# EAGLE schematic brick_analog_limitswitch (EAGLE 7.4.0)
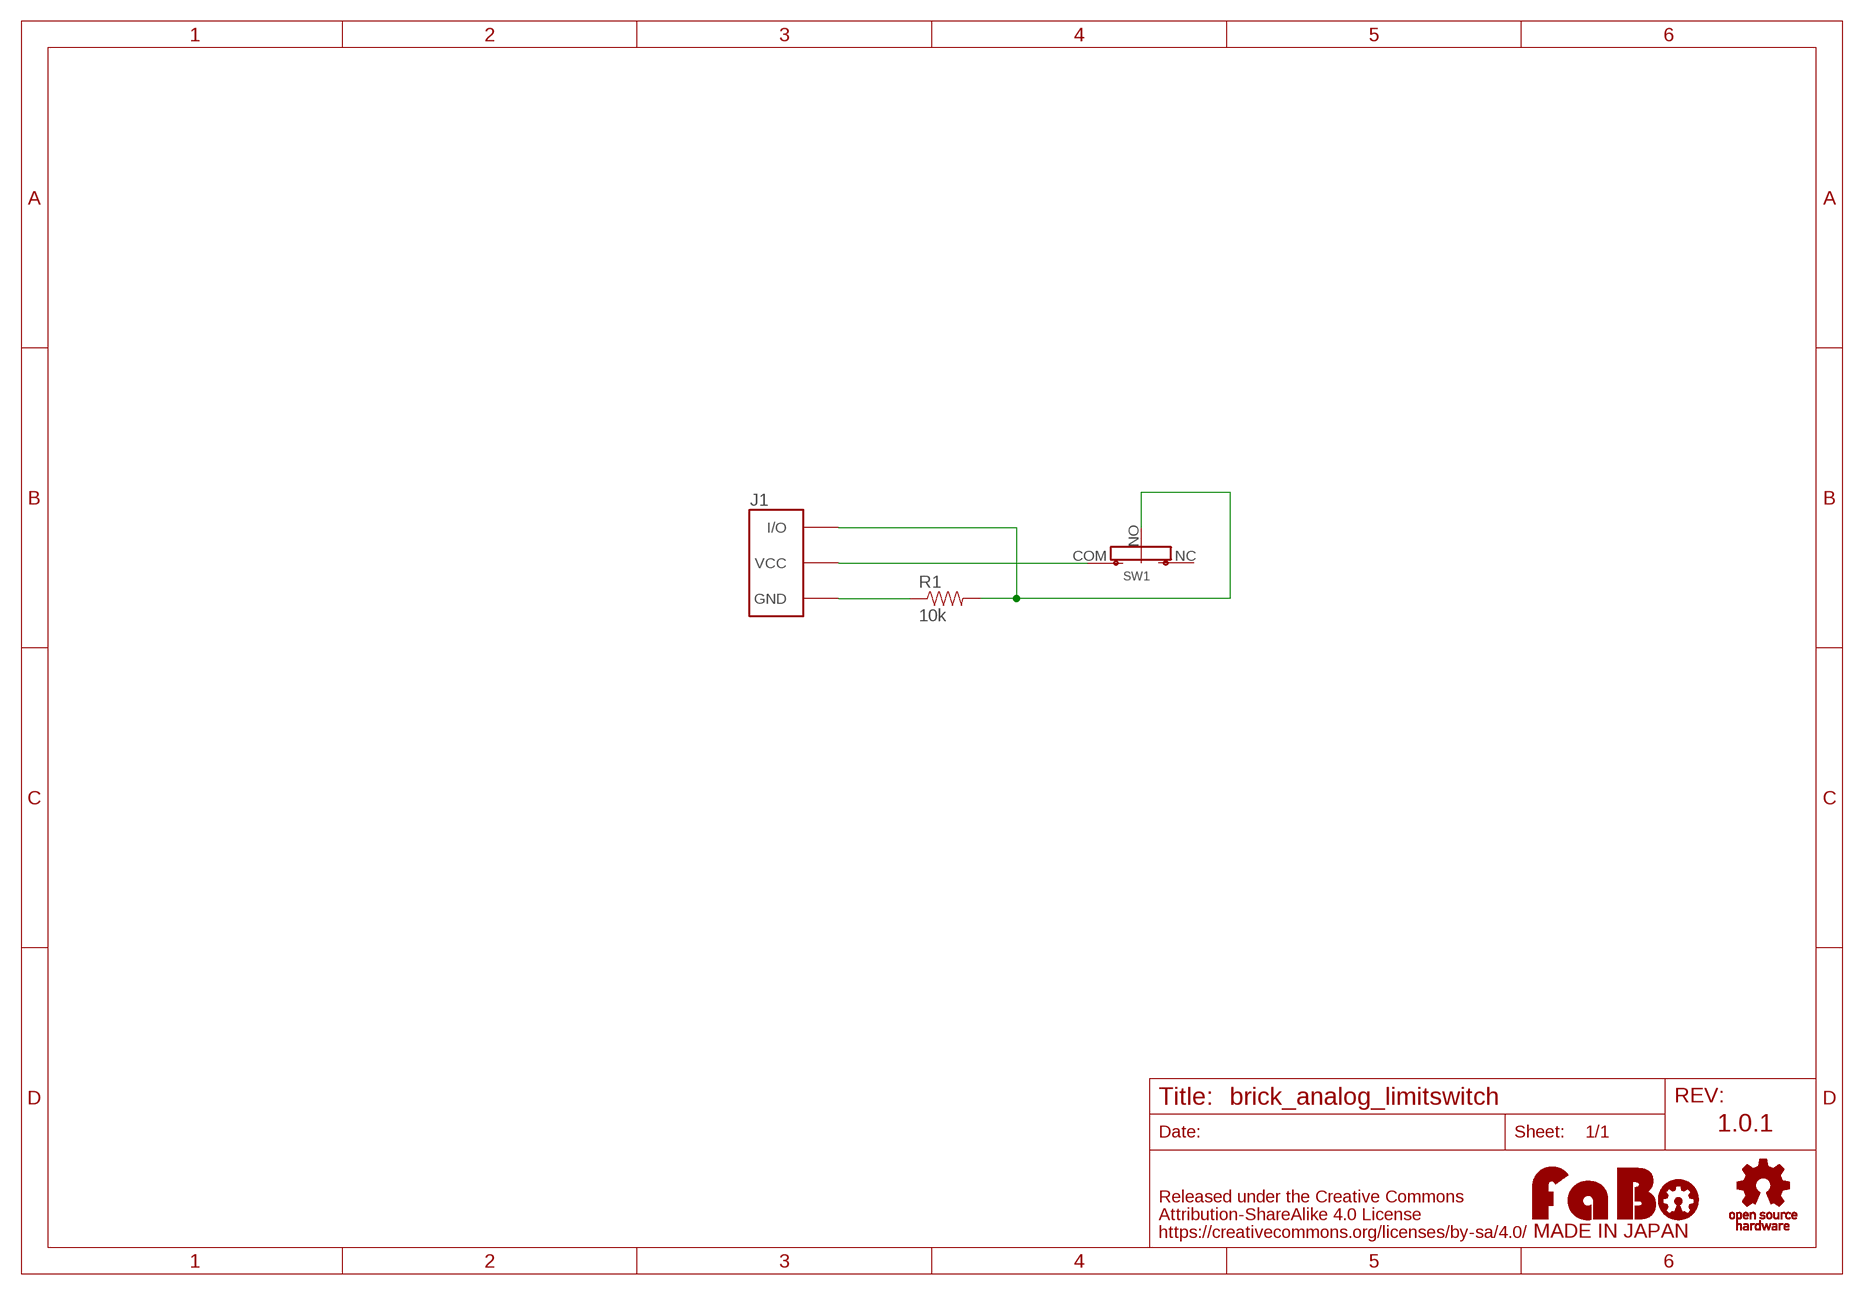
[diagram p0: schematic, sheet 1]

## Parts
J1  FABO_BRICK_3PIN  [FABO_BRICK_3PIN]
R1  10k  RES-PTH-REGULAR  [RES-AXL-REGULAR]
SW1  LIMIT-SWITCH  [LIMIT-SWITCH]
U$2  LOGO_OSHW-T_M  [LOGO_OSHW_T_M]
U$4  LOGO_FABO-M  [LOGO_FABO_M]

## Nets
GND: J1.GND R1.P$1
N$1: J1.VCC SW1.COM(VCC)
N$4: J1.IN/OUT(I/O) R1.P$2 SW1.NO
Unconnected: SW1.NC

## Notes on the sheet
- 1.0.1

## Library data of the parts
J1 = FaBo-Template:FABO_BRICK_3PIN: FaBo Brick 3pin
R1 = FaBo-etc:RES
SW1 = FaBo-Switch:LIMIT-SWITCH
U$2 = FaBo-etc:LOGO_OSHW
U$4 = FaBo-etc:LOGO_FABO